# Altium schematic sheet AUDIO.SchDoc
size A4
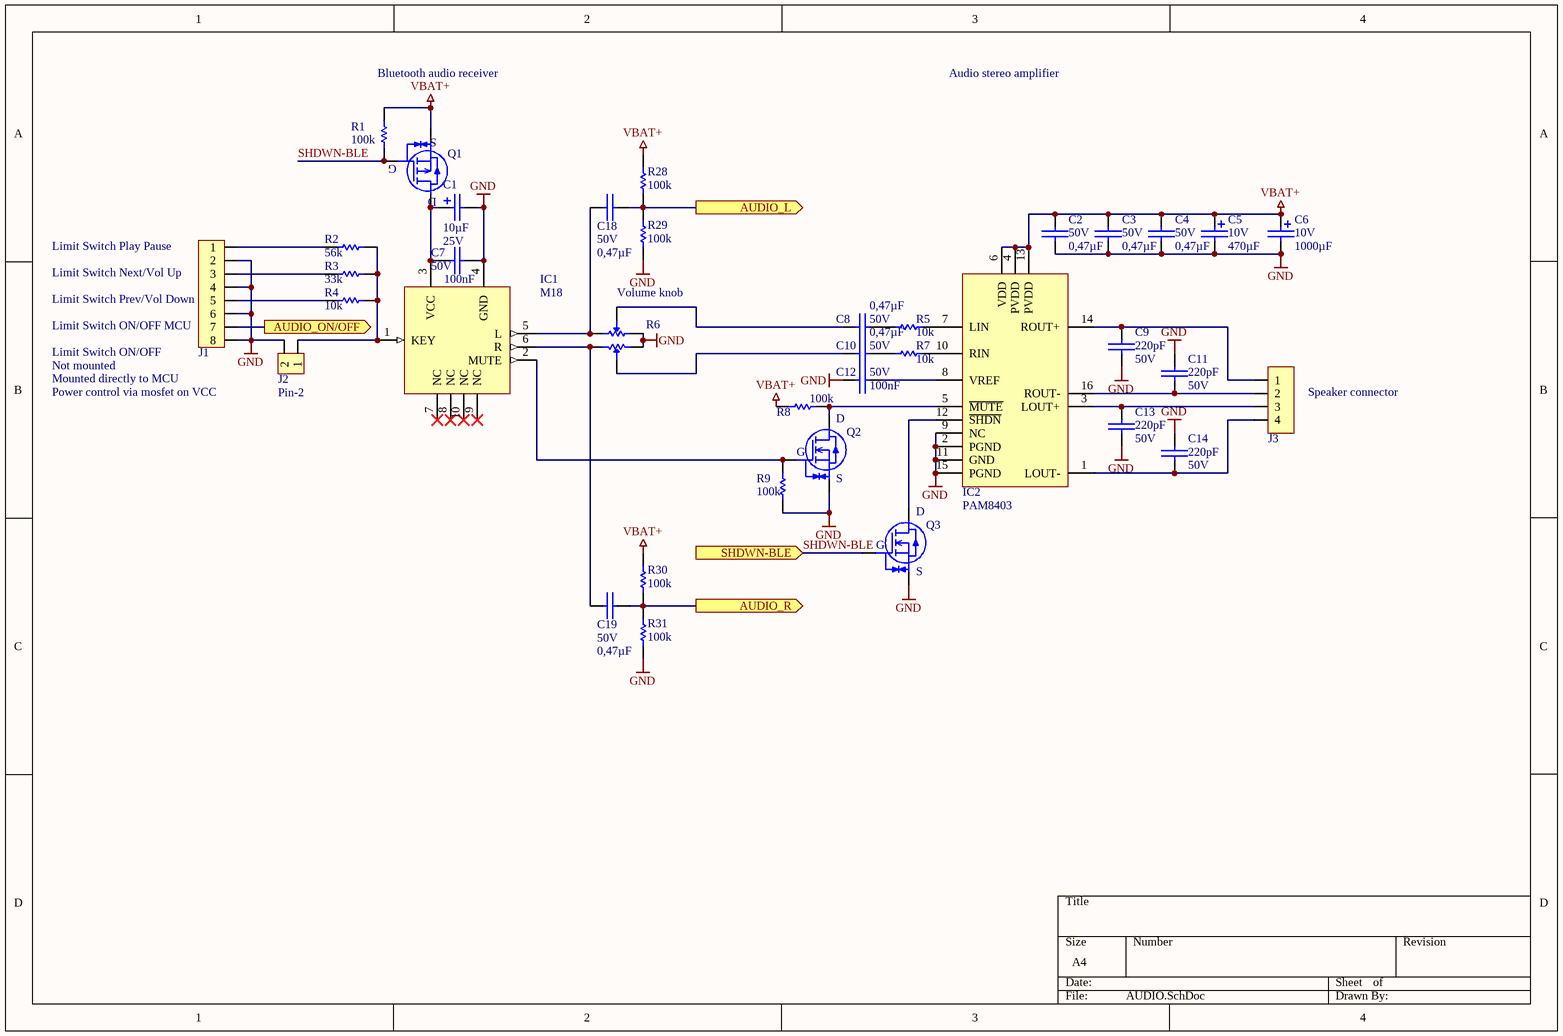
[diagram p0: AUDIO.SchDoc]

## Parts
C1  value 10µF  voltage: 25V  [CD6.3H12TH]  (hidden comment: cap-pol)
C2  value 0,47µF  voltage: 50V  [TH5.08]  (hidden comment: cap_non_pol)
C3  value 0,47µF  voltage: 50V  [TH5.08]  (hidden comment: cap_non_pol)
C4  value 0,47µF  voltage: 50V  [TH5.08]  (hidden comment: cap_non_pol)
C5  value 470µF  voltage: 10V  [CD6.3H12TH]  (hidden comment: cap-pol)
C6  value 1000µF  voltage: 10V  [CD8H12TH]  (hidden comment: cap-pol)
C7  value 100nF  voltage: 50V  [TH5.08]  (hidden comment: cap_non_pol)
C8  value 0,47µF  voltage: 50V  [TH5.08]  (hidden comment: cap_non_pol)
C9  value 220pF  voltage: 50V  [TH5.08]  (hidden comment: cap_non_pol)
C10  value 0,47µF  voltage: 50V  [TH5.08]  (hidden comment: cap_non_pol)
C11  value 220pF  voltage: 50V  [TH5.08]  (hidden comment: cap_non_pol)
C12  value 100nF  voltage: 50V  [TH5.08]  (hidden comment: cap_non_pol)
C13  value 220pF  voltage: 50V  [TH5.08]  (hidden comment: cap_non_pol)
C14  value 220pF  voltage: 50V  [TH5.08]  (hidden comment: cap_non_pol)
C18  value 0,47µF  voltage: 50V  [TH5.08]  (hidden comment: cap_non_pol)
C19  value 0,47µF  voltage: 50V  [TH5.08]  (hidden comment: cap_non_pol)
IC1  M18  [M18]
IC2  PAM8403  [SOIC-16]
J1  Pin-8  [2205114-3]  (value not drawn)
J2  Pin-2  [2-PIN]
J3  Pin-4  [B4B-PH-K]  (value not drawn)
Q1  P_CH_MOSFET2  [TO-220AB]  (value not drawn)
Q2  N_CH_MOSFET2  [TO-92]  (value not drawn)
Q3  N_CH_MOSFET2  [TO-92]  (value not drawn)
R1  value 100k  [TH6.3]  (hidden comment: resistor)
R2  value 56k  [TH6.3]  (hidden comment: resistor)
R3  value 33k  [TH6.3]  (hidden comment: resistor)
R4  value 10k  [TH6.3]  (hidden comment: resistor)
R5  value 10k  [TH6.3]  (hidden comment: resistor)
R6  2-gang potentiometer  [P140KV1-F25BR10K]  (value not drawn)
R7  value 10k  [TH6.3]  (hidden comment: resistor)
R8  value 100k  [TH6.3]  (hidden comment: resistor)
R9  value 100k  [TH6.3]  (hidden comment: resistor)
R28  value 100k  [TH6.3]  (hidden comment: resistor)
R29  value 100k  [TH6.3]  (hidden comment: resistor)
R30  value 100k  [TH6.3]  (hidden comment: resistor)
R31  value 100k  [TH6.3]  (hidden comment: resistor)

## Ports
AUDIO_L (out), AUDIO_ON/OFF (out), AUDIO_R (out), SHDWN-BLE (in)

## Nets
GND: C1.- C2.2 C3.2 C4.2 C5.- C6.- C7.2 C9.2 C11.1 C12.2 C13.2 C14.1 IC1.4(GND) IC2.2(PGND) IC2.9(NC) IC2.11(GND) IC2.15(PGND) J1.2 J1.4 J1.6 J1.8 J2.2 Q2.S Q3.S R6.1 R6.2 R9.1 R29.1 R31.1
VBAT+: C2.1 C3.1 C4.1 C5.+ C6.+ IC2.4(PVDD) IC2.6(VDD) IC2.13(PVDD) Q1.S R1.2 R8.1 R28.2 R30.2
AUDIO_L: C18.1 R28.1 R29.2 ; port AUDIO_L
AUDIO_ON/OFF: J1.7 ; port AUDIO_ON/OFF
AUDIO_R: C19.1 R30.1 R31.2 ; port AUDIO_R
SHDWN-BLE: Q1.G Q3.G R1.1 ; port SHDWN-BLE
NetC1_+: C1.+ C7.1 IC1.3(VCC) Q1.D
NetC8_1: C8.1 R5.2
NetC8_2: C8.2 R6.4
NetC9_1: C9.1 IC2.14(ROUT+) J3.1
NetC10_1: C10.1 R7.2
NetC10_2: C10.2 R6.3
NetC11_2: C11.2 IC2.16(ROUT-) J3.2
NetC12_1: C12.1 IC2.8(VREF)
NetC13_1: C13.1 IC2.3(LOUT+) J3.3
NetC14_2: C14.2 IC2.1(LOUT-) J3.4
NetC18_2: C18.2 IC1.5(L) R6.6
NetC19_2: C19.2 IC1.6(R) R6.5
NetIC1_1: IC1.1(KEY) J2.1 R2.1 R3.1 R4.1
NetIC1_2: IC1.2(MUTE) Q2.G R9.2
NetIC2_5: IC2.5(~{MUTE}) Q2.D R8.2
NetIC2_7: IC2.7(LIN) R5.1
NetIC2_10: IC2.10(RIN) R7.1
NetIC2_12: IC2.12(~{SHDN}) Q3.D
NetJ1_1: J1.1 R2.2
NetJ1_3: J1.3 R3.2
NetJ1_5: J1.5 R4.2

Not connected (* = marked no-connect by the designer): IC1 7(NC)* 8(NC)* 9(NC)* 10(NC)*

## Notes on the sheet
- Bluetooth audio receiver
- Audio stereo amplifier
- (near J1) Limit Switch Play Pause
- (near J1) Limit Switch Next/Vol Up
- (near J1) Limit Switch Prev/Vol Down
- (near R6) Volume knob
- Not mounted
- Limit Switch ON/OFF
- (near J1) Mounted directly to MCU
- (near J1) Limit Switch ON/OFF MCU
- Power control via mosfet on VCC
- (near J3) Speaker connector

## Library data of the parts
C1 = 4: CAP ALUM 10UF 20% 25V TH; manufacturer_ref: ECF1KM100E12OTPO; manufacturer: Yunxing; id: 4; dielectric: Aluminium; tolerance: 20%; package: d6,3h12TH; supplier_1: lcsc; supplier_1_partnumber: C2841587; price: 0,0229; status: active
C2-C4 C8 C10 C18 C19 = 36: CAP CER TH 0.47µF X7R 50V; manufacturer_ref: C2761753; manufacturer: Dersonic; id: 36; tolerance: 10%; dielectric: X7R; package: TH5.08; supplier_1: lcsc; supplier_1_partnumber: C2761753; price: 0,0536; status: active
C5 = 2: CAP ALUM 470UF 20% 10V TH; manufacturer_ref: EGH1AM471E12OT; manufacturer: AISHI(Aihua Group); id: 2; dielectric: Aluminium; tolerance: 20%; package: d6.3h12TH; supplier_1: lcsc; supplier_1_partnumber: C2924460; price: 0,0391; status: active
C6 = 3: CAP ALUM 1000UF 20% 10V TH; manufacturer_ref: EWH1AM102F120T; manufacturer: AISHI(Aihua Group); id: 3; dielectric: Aluminium; tolerance: 20%; package: d8h12TH; supplier_1: lcsc; supplier_1_partnumber: C105310; price: 0,0464; status: active
C7 C12 = 37: CAP CER TH 100nF X7R 50V; manufacturer_ref: C2761753; manufacturer: FH; id: 37; tolerance: 10%; dielectric: X7R; package: TH5.08; supplier_1: lcsc; supplier_1_partnumber: C385200; price: 0,0237; status: active
C9 C11 C13 C14 = 38: CAP CER TH 100nF X7R 50V; manufacturer_ref: C2761753; manufacturer: WMEC; id: 38; tolerance: 10%; dielectric: X7R; package: TH5.08; supplier_1: lcsc; supplier_1_partnumber: C2905888; price: 0,0237; status: active
IC1 = 55: M18 Bluetooth 4.2 Audio-receiver Module Lossless; manufacturer_ref: MH-M18; id: 55; type: Wireless (Bluetooth Audio); package: M18; supplier_1: banggood; supplier_1_partnumber: 1527332; price: 2,5; status: active
IC2 = 54: 3W x 2 RL=4Ω 2.5V ~ 5.5V (stereo) Class D SOIC-16 Audio Power OpAmps; manufacturer_ref: PAM8403DR-H; manufacturer: Diodes Incorporated; id: 54; type: Analog (Stereo Amp); package: 16-SOIC; supplier_1: lcsc; supplier_1_partnumber: C17337; price: 0,5806; status: active
J1 = 31: CA 200MM 08 POS. MOW-PB M-M VALU; manufacturer: TE Connectivity AMP Connectors; id: 31; nbr_positions_total: 8; manufacturer_ref: 2205114-3; package: Pin-8DR; supplier_1: digikey; supplier_1_partnumber: A123436-ND; price: 2,29; status: active
J2 = 18: 'CONN 2 PIN SOLDER PADS; manufacturer_ref: TH-2; id: 18; nbr_positions_total: 2; package: Pin-2SR; price: 0; status: active
J3 = 32: CONN HEADER VERT 4POS 2MM; manufacturer_ref: B4B-PH-K(LF)(SN); manufacturer: JST Sales America Inc.; id: 32; nbr_positions_total: 4; package: Pin-4SR; supplier_1: digikey; supplier_1_partnumber: B4B-PH-K(LF)(SN)-ND; price: 0,23; status: active
Q1 = 12: MOSFET P-CH 60V 17A TO-220AB; manufacturer_ref: HSP6113; manufacturer: HUASHUO; id: 12; voltage_vgs_min: -2.5V; type: P channel; current_rating: 17A; voltage_vds: 60V; package: TO-220AB; supplier_1: lcsc; supplier_1_partnumber: C2903571; price: 0,4184; status: active
Q2 Q3 = 13: MOSFET N-CH 60V 0.2A TO-92; manufacturer_ref: 2N7000; manufacturer: Changjiang Electronics Tech (CJ); id: 13; voltage_vgs_min: 3v; type: N channel; current_rating: 0.2A; voltage_vds: 60V; package: TO-92; supplier_1: lcsc; supplier_1_partnumber: C9114; price: 0,0417; status: active
R1 R8 R9 R28-R31 = 56: RES TH 100k OHM 5% 1/4W; manufacturer_ref: CR1/4W-100K±5%-RT52; manufacturer: VO; id: 56; tolerance: 5%; power: 1/4W; package: TH6.3; supplier_1: lcsc; supplier_1_partnumber: C2894520; price: 0,0038; status: active
R2 = 54: RES TH 56k OHM 5% 1/4W; manufacturer_ref: CR1/4W-56K±5%-OT26; manufacturer: VO; id: 54; tolerance: 5%; power: 1/4W; package: TH6.3; supplier_1: lcsc; supplier_1_partnumber: C2896856; price: 0,0038; status: active
R3 = 53: RES TH 33k OHM 5% 1/4W; manufacturer_ref: CR1/4W-33K±5%-OT26; manufacturer: VO; id: 53; tolerance: 5%; power: 1/4W; package: TH6.3; supplier_1: lcsc; supplier_1_partnumber: C2894551; price: 0,0038; status: active
R4 R5 R7 = 52: RES TH 10k OHM 5% 1/4W; manufacturer_ref: CR1/4W-10K±5%-OT26; manufacturer: VO; id: 52; tolerance: 5%; power: 1/4W; package: TH6.3; supplier_1: lcsc; supplier_1_partnumber: C2894537; price: 0,0038; status: active
R6 = 3: POT 10K OHM 1/20W PLASTIC LINEAR; manufacturer: TT Electronics/BI; id: 3; manufacturer_ref: P140KV1-F25BR10K; value: 10k; power: 1/20W; type: 2-GANG POTENTIOMETER; package: P140KV1-F25BR10K; supplier_1: digikey; supplier_1_partnumber: 987-1296-ND; price: 0,97; status: active